# Altium schematic sheet NegativePwr.SchDoc
size A4; SheetNumber: 3; SheetTotal: 11
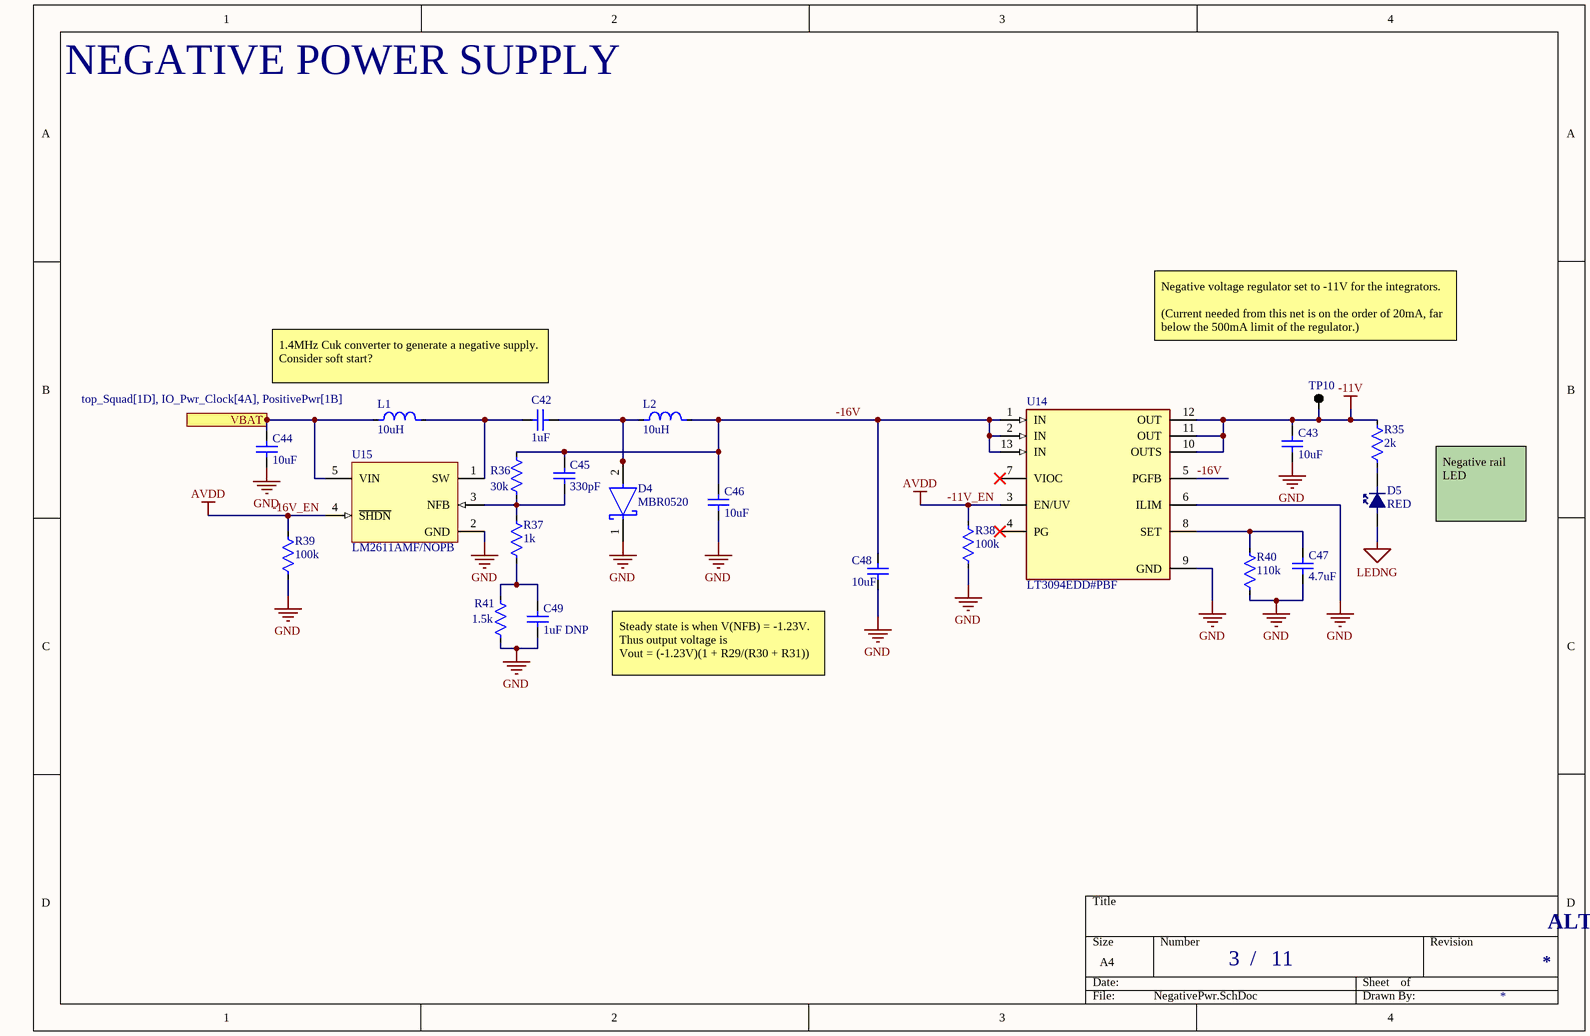
[diagram p0: NegativePwr.SchDoc]

## Parts
C42  1uF  [CAP 0603 IPC MID DENSITY]
C43  10uF  [CAP 0805 IPC MID DENSITY]
C44  10uF  [CAP 0805 IPC MID DENSITY]
C45  330pF  [CAP 1206 NON-IPC KEMET NP0]
C46  10uF  [CAP 0805 IPC MID DENSITY]
C47  4.7uF  [CAP 0805 NON-IPC KEMET X5R]
C48  10uF  [CAP 0805 IPC MID DENSITY]
C49  1uF DNP  [CAP 0603 IPC MID DENSITY]
D4  MBR0520  [SOD-123 ONSEMI SMALL PADS]
D5  RED  [LED 0603 MID DENSITY]
L1  10uH  [IND VLS3012CX-1 NONSTANDARD TDK]
L2  10uH  [IND VLS3012CX-1 NONSTANDARD TDK]
R35  2k  [RES 0603 IPC MID DENSITY]
R36  30k  [RES 0805 IPC HIGH DENSITY]
R37  1k  [RES 0603 IPC MID DENSITY]
R38  100k  [RES 0603 IPC MID DENSITY]
R39  100k  [RES 0603 IPC MID DENSITY]
R40  110k  [RES 0603 IPC MID DENSITY]
R41  1.5k  [RES 1206 NON-IPC VISHAY]
TP10  Testpoint  [TESTPOINT THT]  (value not drawn)  (no BOM)
U14  LT3094EDD#PBF  [12DFN 3x3MM EP IPC MID DENSITY]
U15  LM2611AMF/NOPB  [SOT23-5 MID DENSITY]

## Ports
VBAT (in, see top_Squad[1D], IO_Pwr_Clock[4A], PositivePwr[1B])

## Nets
-11V: C43.1 R35.2 TP10.1 U14.10(OUTS) U14.11(OUT) U14.12(OUT)
-11V_EN: R38.1 R39.1 U14.3(EN/UV) U15.4(~{SHDN})  [also labelled -16V_EN, AVDD]
GND: C43.2 C44.1 C46.2 C47.2 C48.2 C49.2 D4.1(C) R38.2 R39.2 R40.2 R41.1 U14.6(ILIM) U14.9(GND) U15.2(GND)
LEDNG: D5.2
-16V: C45.1 C46.1 C48.1 L2.2 R36.2 U14.1(IN) U14.2(IN) U14.5(PGFB) U14.13(IN)
VBAT: C44.2 L1.1 U15.5(VIN) ; port VBAT
NetC42_1: C42.1 L1.2 U15.1(SW)
NetC42_2: C42.2 D4.2(A) L2.1
NetC45_2: C45.2 R36.1 R37.2 U15.3(NFB)
NetC47_1: C47.1 R40.1 U14.8(SET)
NetC49_1: C49.1 R37.1 R41.2
NetD5_1: D5.1 R35.1

Not connected (* = marked no-connect by the designer): U14 4(PG)* 7(VIOC)*

## Notes on the sheet
- NEGATIVE POWER SUPPLY
- 1.4MHz Cuk converter to generate a negative supply. Consider soft start?
- Negative voltage regulator set to -11V for the integrators.
  (Current needed from this net is on the order of 20mA, far below the 500mA limit of the regulator.)
- Negative rail LED
- Steady state is when V(NFB) = -1.23V.
  Thus output voltage is
  Vout = (-1.23V)(1 + R29/(R30 + R31))
- /
- ALTAIR PhotoDiode ReadOut (PDRO) - Squad

## Library data of the parts
C42 C49 = CAP: Murata GRT188R61H105KE13D - Cap MLCC AEC-Q200 X5R 1uF 50V 0603; MF: Murata; MP: GRT188R61H105KE13D
C43 C44 C46 C48 = CAP: Murata GRM21BR61E106KA73L - Cap Ceramic 10uF 10% 25V X5R 0805; MF: Murata; MP: GRM21BR61E106KA73L
C45 = CAP: Kemet C1206C331J5GACTU - Cap Ceramic 330pF 50V 5% NP0 1206; MF: Kemet; MP: C1206C331J5GACTU
C47 = CAP: Kemet C0805C475K8PACTU - Cap Ceramic 4.7uF 10V X5R 0805; MF: Kemet; MP: C0805C475K8PACTU
D4 = Schottky: DIODE SCHOTTKY 20V 500MA SOD123; Polarity: Standard; Peak Non-Repetitive Surge Current: 5.5A; Forward Voltage: 385mV; Element Configuration: Single; Peak Reverse Current: 250uA; MF: onsemi; MP: MBR0520LT1G; Max Repetitive Reverse Voltage (Vrrm): 20V; Voltage Rating (DC): 20V; Case/Package: SOD-123-2; Number of Pins: 2; Output Current: 500mA; Min Operating Temperature: -65°C; Lead Free: Lead Free; REACH SVHC: No SVHC; Max Reverse Voltage (DC): 20V; Termination: SMD/SMT; Average Rectified Current: 500mA; Max Surge Current: 5.5A; Package Quantity: 3000; Height: 1.12mm; Current Rating: 500mA; Forward Current: 500mA; Max Forward Surge Current (Ifsm): 5.5A; Packaging: Tape and Reel; Length: 2.69mm; Radiation Hardening: No; Max Reverse Leakage Current: 250uA; Width: 1.6mm; Contact Plating: Tin; Max Operating Temperature: 125°C
D5 = LED-blue: LED RED CLEAR 0603 SMD; Color: Blue; Luminous Intensity: 145mcd; Forward Current: 30mA; Forward Voltage: 3.2V; Wavelength: 470nm; Viewing Angle: 140°; Lens Style: Clear,Rectangular; Test Current: 20mA; MF: Wurth Electronics; MP: 150060RS75000; RoHS: Yes; Category: LEDs; Stock 1: 66561; Mount: Surface Mount; Case/Package: 0603; Case Code (Metric): 1608; Case Code (Imperial): 0603; Min Operating Temperature: -40°C; Max Operating Temperature: 85°C; Package Quantity: 4000; Packaging: Cut Tape; Dominant Wavelength: 470nm; Length: 1.6mm; Height: 0.7mm; Width: 0.8mm; REACH SVHC: Unknown; ComponentLink1URL: https://datasheet.ciiva.com/29563/150060bs75000-29563034.pdf?src-supplier=Digi-Key; ComponentLink1Description: https://datasheet.ciiva.com/29563/150060bs75000-29563034.pdf?src-supplier=Digi-Key; ComponentLink2URL: https://datasheet.ciiva.com/29279/759426-da-01-en-chipled-0603-w-kl-blau-150060bs75000-29279193.pdf?src-supplier=Conrad; ComponentLink2Description: https://datasheet.ciiva.com/29279/759426-da-01-en-chipled-0603-w-kl-blau-150060bs75000-29279193.pdf?src-supplier=Conrad; ComponentLink3URL: https://datasheet.ciiva.com/29563/150060bs75000-29563035.pdf?src-supplier=Digi-Key; ComponentLink3Description: https://datasheet.ciiva.com/29563/150060bs75000-29563035.pdf?src-supplier=Digi-Key; ComponentLink4URL: https://datasheet.ciiva.com/29563/150060bs75000-29563036.pdf?src-supplier=Digi-Key; ComponentLink4Description: https://datasheet.ciiva.com/29563/150060bs75000-29563036.pdf?src-supplier=Digi-Key; ComponentLink5URL: https://datasheet.ciiva.com/22656/1911343-22656939.pdf?src-supplier=Element14; ComponentLink5Description: https://datasheet.ciiva.com/22656/1911343-22656939.pdf?src-supplier=Element14; ComponentLink6URL: https://datasheet.ciiva.com/48430/150060bs75000-eng-tds-48430039.pdf?src-supplier=Distrelec; ComponentLink6Description: https://datasheet.ciiva.com/48430/150060bs75000-eng-tds-48430039.pdf?src-supplier=Distrelec; Supplier 1: Digi-Key; Supplier Part Number 1: 732-4966-1-ND
L1 L2 = IND: TDK VLS3012CX-100M-1 - Inductor 10uH 20% 1.25A 0.324Ohm NonstandardPkg; DC Resistance (DCR): 324mR; Core Material: Ferrite; Saturation Current: 1A; Test Frequency: 100kHz; MF: TDK Corporation; Inductance: 10uH; Height: 1.20mm; Width: 3.00mm; Inductance Tolerance: 20%; Lead Free: Lead Free; Length: 3.00mm; Max Operating Temperature: 105°C; Resistor Type: Wirewound; Height - Seated (Max): 0.047inch; Series: VLS-CX-1; Packaging: Tape and Reel; Number of Pins: 2; Tolerance: 20%; Mount: Surface Mount; Max DC Current: 1.25A; Min Operating Temperature: -40°C; Termination: SMD/SMT; MP: VLS3012CX-100M-1
R35 = RES: Panasonic ERJ-3EKF2001V Res Thick Film 0603 2K Ohm 1% 1/10W ±100ppm/°C; MF: Panasonic Electronic Components; MP: ERJ-3EKF2001V
R36 = RES: Panasonic ERA-6AEB303V - Res 30kOhm 0.1% 1/8W 0805; MF: Panasonic Electronic Components; MP: ERA-6AEB303V
R37 = RES: Panasonic ERJ-U03F1001V - Res SMD 1 kOhm 1% 1/10W 0603; MF: Panasonic Electronic Components; MP: ERJ-U03F1001V
R38 R39 = RES: Panasonic ERA-3ARB104V - Res SMD 0603 0.1% 0.10W T.C. 10ppm 100K; MF: Panasonic Electronic Components; MP: ERA-3ARB104V
R40 = RES: Panasonic ERA-3AEB114V - Res 110k 0.1% 1/10W SMD 0603; MF: Panasonic Electronic Components; MP: ERA-3AEB114V
R41 = RES: Vishay TNPU12061K50BZEN00 - Res 1.5kOhm 0.1% 1/4W 1206; MF: Vishay Dale; MP: TNPU12061K50BZEN00
U14 = LT3094EDD#PBF: -20V 500mA Ultralow Noise Ultrahigh PSRR Adjustable Negative Linear Regulator 12DFN; MF: Analog Devices; RoHS Compliant: Yes; MP: LT3094EDD#PBF
U15 = LM2611AMF: 1.4MHz Cuk Converter, 5-pin SOT-23, Pb-Free; PowerWise: N; CompType: Switcher; PackageTopMarking: S40A*XTT; MF: Texas Instruments; ComponentLink1URL: http://www.ti.com/general/docs/lit/getliterature.tsp?genericPartNumber=LM2611&fileType=pdf; PackageDescription: Molded SOT-23, .115 x .063 x .040 in Body, 5 Lead, .0375 in Pitch; ComponentLink1Description: Datasheet URL; PackageReference: DBV0005A; PinCount: 5; RoHS: Y; MP: LM2611AMF/NOPB